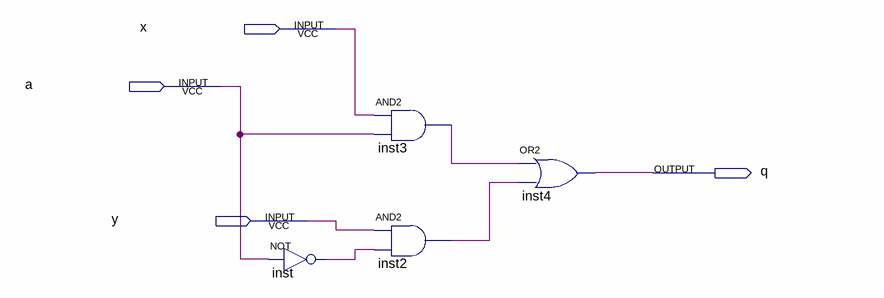
[diagram p0: schematic sheet]
// Quartus schematic s41_mux.bdf as structural Verilog: 4 symbols, 4 pins
module s41_mux (
  input  x,
  input  a,
  input  y,
  output q
);

  wire inst2_out, inst3_out, inst_out;

  not inst (inst_out, a);
  and inst3 (inst3_out, x, a);
  and inst2 (inst2_out, y, inst_out);
  or inst4 (q, inst3_out, inst2_out);
endmodule
